# Altium schematic sheet Sheet3.SchDoc
size A4
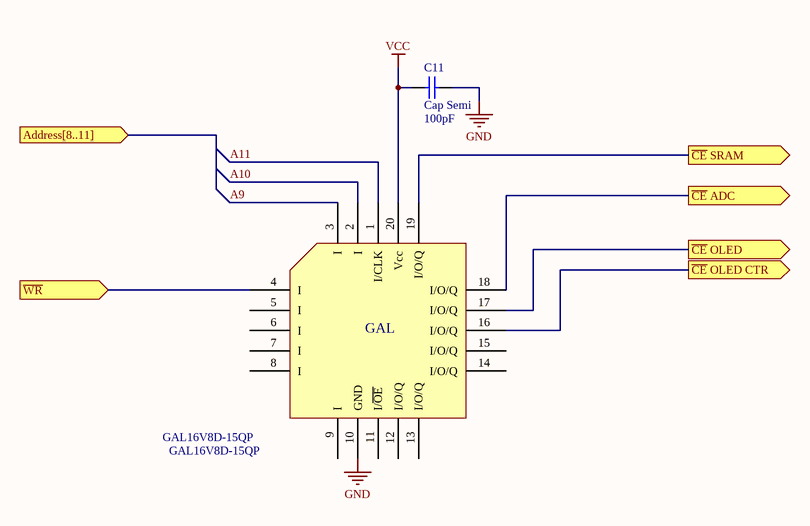
[diagram p0: Sheet3.SchDoc]

## Parts
C11  Cap Semi  value 100pF  [C1210]
GAL16V8D-15QP  GAL16V8D-15QP  [GAL 16V8D-10LJ/-10QL PLCC 20-PIN]

## Ports
Address[8..11] (in), ~{CE} ADC (out), ~{CE} OLED (out), ~{CE} OLED CTR (out), ~{CE} SRAM (out), ~{WR} (in)

## Nets
GND: C11.1 GAL16V8D-15QP.10(GND)
VCC: C11.2 GAL16V8D-15QP.20(Vcc)
A9: GAL16V8D-15QP.3(I)
A10: GAL16V8D-15QP.2(I)
A11: GAL16V8D-15QP.1(I/CLK)
~{CE} ADC: GAL16V8D-15QP.18(I/O/Q) ; port ~{CE} ADC
~{CE} OLED: GAL16V8D-15QP.17(I/O/Q) ; port ~{CE} OLED
~{CE} OLED CTR: GAL16V8D-15QP.16(I/O/Q) ; port ~{CE} OLED CTR
~{CE} SRAM: GAL16V8D-15QP.19(I/O/Q) ; port ~{CE} SRAM
~{WR}: GAL16V8D-15QP.4(I) ; port ~{WR}

Not connected (* = marked no-connect by the designer): GAL16V8D-15QP 5(I) 6(I) 7(I) 8(I) 9(I) 11(I/~{OE}) 12(I/O/Q) 13(I/O/Q) 14(I/O/Q) 15(I/O/Q)

## Notes on the sheet
- (in symbol GAL16V8D-15QP) GAL

## Library data of the parts
C11 = Cap Semi: Capacitor (Semiconductor SIM Model); Published: 8-Jun-2000; LatestRevisionDate: 29-May-2009; LatestRevisionNote: IPC-7351 Footprint Added.; PackageReference: C1206; Publisher: Altium Limited; PackageDescription: Chip Capacitor
GAL16V8D-15QP = GAL16V8D-15QP: GAL - Generic Array Logic